# Altium schematic sheet MOD-COIL-LN2-21.SchDoc: MOD-COIL-LN2-21
size A3; SPICEModelCacheRYPVXPCY: <root> / <DocumentId>RYPVXPCY</DocumentId> / </root>; Author: M.Beldyga; CompanyName: WUT ISE; DrawnBy: M.Beldyga; Organization: WUT ISE; Address1: PW ISE; Address2: Nowowiejska 15/19 00-665 Warsaw; Address3: micbeldyga@gmail.com; SheetNumber: 1; SheetTotal: 9; ModifiedBy: -; CheckedDate: -; Title2: MODULIQ; DivGrp: WUT ISE; Designer: M.Beldyga; ModifiedDate: -; ProjectName: Sensor Box
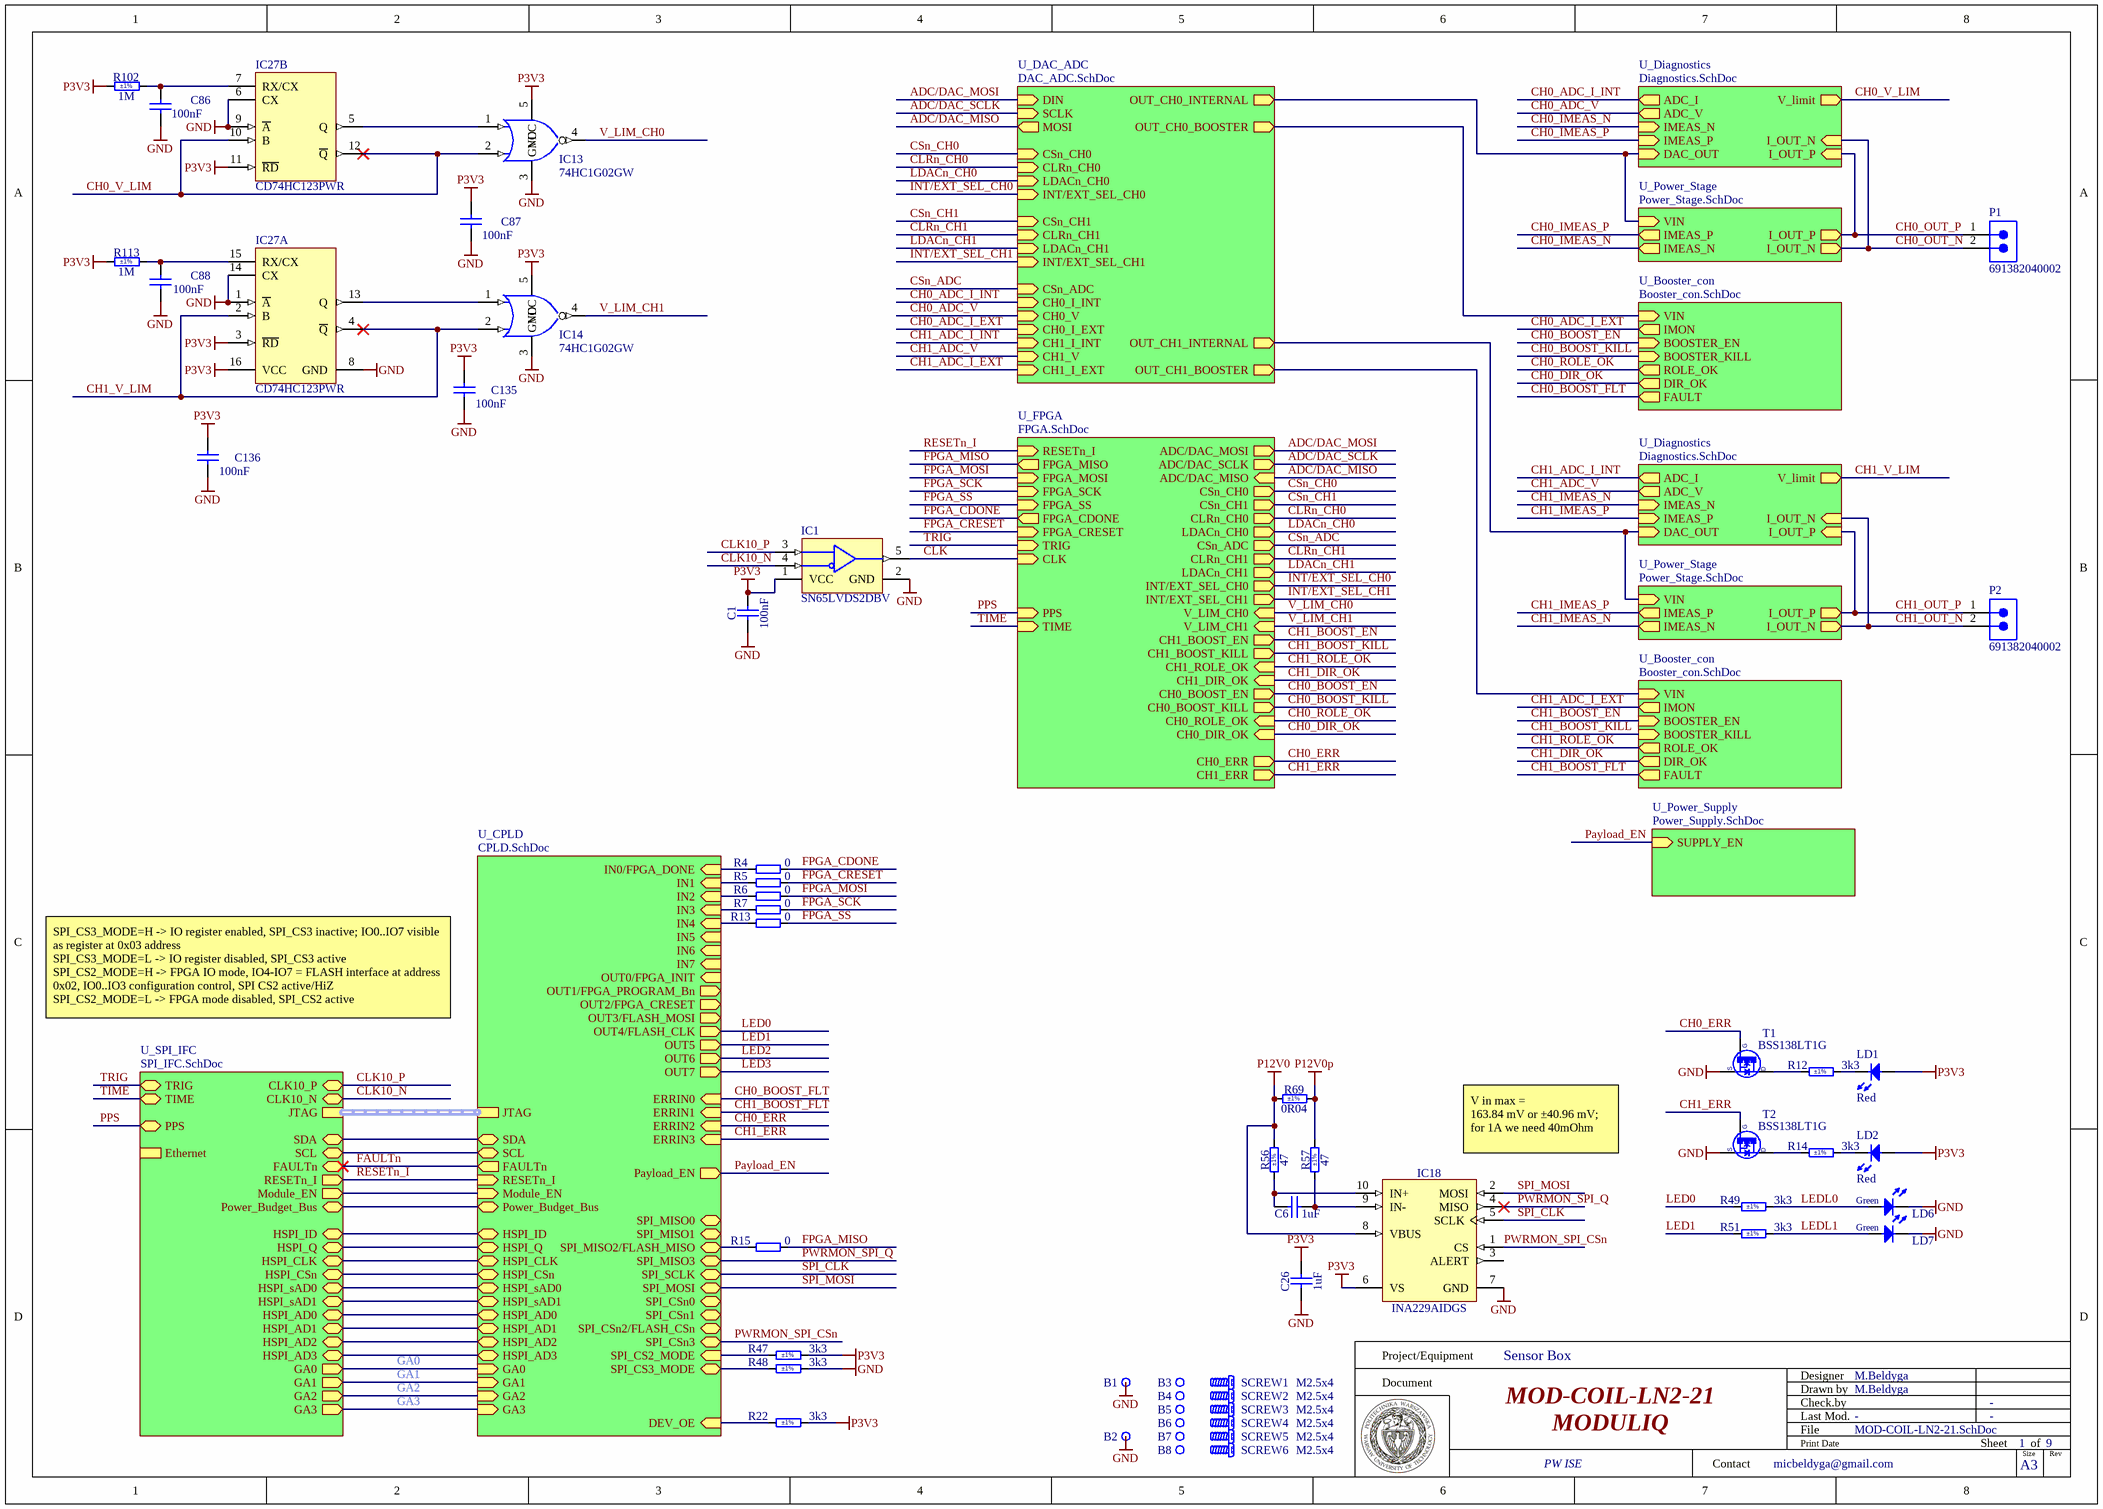
[diagram p0: MOD-COIL-LN2-21.SchDoc]

## Parts
B1  Plated Hole  [MTG270_500]  (value not drawn)  (no BOM)
B2  Plated Hole  [MTG270_500]  (value not drawn)  (no BOM)
B3  Plated Hole  [MTG270_500]  (value not drawn)  (no BOM)
B4  Plated Hole  [MTG270_500]  (value not drawn)  (no BOM)
B5  Plated Hole  [MTG270_500]  (value not drawn)  (no BOM)
B6  Plated Hole  [MTG270_500]  (value not drawn)  (no BOM)
B7  Plated Hole  [MTG270_500]  (value not drawn)  (no BOM)
B8  Plated Hole  [MTG270_500]  (value not drawn)  (no BOM)
C1  100nF  [CAPC1005X55N]
C6  1uF  [CAPC1005X55N]
C26  1uF  [CAPC1005X55N]
C86  100nF  [CAPC1005X55N]
C87  100nF  [CAPC1005X55N]
C88  100nF  [CAPC1005X55N]
C135  100nF  [CAPC1005X55N]
C136  100nF  [CAPC1005X55N]
IC1  SN65LVDS2DBV  [SOT95P280X145-5N]
IC13  74HC1G02GW  [SOT65P212X110-5N]
IC14  74HC1G02GW  [SOT65P212X110-5N]
IC18  INA229AIDGS  [SOP50P490X110-10N]
IC27  CD74HC123PWR  [SOP65P640X110-16N]  (parts A,B of 2)
LD1  Red  [LED_AVAGO_HSMC-C120]
LD2  Red  [LED_AVAGO_HSMC-C120]
LD6  Green  [LED_AVAGO_HSME-C120]
LD7  Green  [LED_AVAGO_HSME-C120]
P1  691382040002  [691382040002]
P2  691382040002  [691382040002]
R4  0  [RESC1005X40N]
R5  0  [RESC1005X40N]
R6  0  [RESC1005X40N]
R7  0  [RESC1005X40N]
R12  3k3  Tolerance: ±1%  [RESC1005X40N]
R13  0  [RESC1005X40N]
R14  3k3  Tolerance: ±1%  [RESC1005X40N]
R15  0  [RESC1005X40N]
R22  3k3  Tolerance: ±1%  [RESC1005X40N]
R47  3k3  Tolerance: ±1%  [RESC1005X40N]
R48  3k3  Tolerance: ±1%  [RESC1005X40N]
R49  3k3  Tolerance: ±1%  [RESC1005X40N]
R51  3k3  Tolerance: ±1%  [RESC1005X40N]
R56  47  Tolerance: ±1%  [RESC1608X55N]
R57  47  Tolerance: ±1%  [RESC1608X55N]
R69  0R04  Tolerance: ±1%  [RESC3216X89N]
R102  1M  Tolerance: ±1%  [RESC1005X40N]
R113  1M  Tolerance: ±1%  [RESC1005X40N]
SCREW1  M2.5x4  [BOSSARD_BN5687-3061587_v]
SCREW2  M2.5x4  [BOSSARD_BN5687-3061587_v]
SCREW3  M2.5x4  [BOSSARD_BN5687-3061587_v]
SCREW4  M2.5x4  [BOSSARD_BN5687-3061587_v]
SCREW5  M2.5x4  [BOSSARD_BN5687-3061587_v]
SCREW6  M2.5x4  [BOSSARD_BN5687-3061587_v]
T1  BSS138LT1G  [SOT95P240X110-3N]
T2  BSS138LT1G  [SOT95P240X110-3N]

## Sub-sheets
U_Booster_con = Booster_con.SchDoc: VIN (in), IMON (out), BOOSTER_EN (in), BOOSTER_KILL (in), ROLE_OK (out), DIR_OK (out), FAULT (out)
U_Booster_con = Booster_con.SchDoc: VIN (in), IMON (out), BOOSTER_EN (in), BOOSTER_KILL (in), ROLE_OK (out), DIR_OK (out), FAULT (out)
U_CPLD = CPLD.SchDoc: SDA (bidir), SCL (bidir), RESETn_I (in), HSPI_ID (bidir), HSPI_Q (bidir), HSPI_CLK (bidir), HSPI_CSn (bidir), HSPI_sAD0 (bidir), HSPI_sAD1 (bidir), HSPI_AD0 (bidir), HSPI_AD1 (bidir), HSPI_AD2 (bidir), HSPI_AD3 (bidir), SPI_MISO2/FLASH_MISO (bidir), SPI_CSn3 (bidir), SPI_CSn1 (bidir), SPI_SCLK (bidir), SPI_MISO3 (bidir), SPI_MISO0 (bidir), SPI_CSn0 (bidir), SPI_MOSI (bidir), SPI_CSn2/FLASH_CSn (bidir), SPI_MISO1 (bidir), GA0 (in), GA1 (in), GA2 (in), GA3 (in), DEV_OE (in), FAULTn (out), Module_EN (in), IN0/FPGA_DONE (in), IN1 (in), IN2 (in), IN3 (in), IN4 (in), IN5 (in), IN6 (in), IN7 (in), OUT0/FPGA_INIT (in), OUT1/FPGA_PROGRAM_Bn (out), OUT2/FPGA_CRESET (out), OUT3/FLASH_MOSI (out), OUT4/FLASH_CLK (out), OUT5 (out), OUT6 (out), OUT7 (out), SPI_CS3_MODE (bidir), SPI_CS2_MODE (in), Payload_EN (out), Power_Budget_Bus (bidir), JTAG (harness JTAG), ERRIN0 (in), ERRIN1 (in), ERRIN2 (in), ERRIN3 (in)
U_DAC_ADC = DAC_ADC.SchDoc: DIN (in), SCLK (in), CSn_CH0 (in), CLRn_CH0 (in), LDACn_CH0 (in), OUT_CH0_INTERNAL (out), OUT_CH0_BOOSTER (out), INT/EXT_SEL_CH0 (in), CSn_CH1 (in), CLRn_CH1 (in), LDACn_CH1 (in), OUT_CH1_INTERNAL (out), OUT_CH1_BOOSTER (out), INT/EXT_SEL_CH1 (in), CSn_ADC (in), CH0_V (in), CH1_V (in), CH0_I_INT (in), CH1_I_INT (in), CH0_I_EXT (in), CH1_I_EXT (in), MOSI (out)
U_Diagnostics = Diagnostics.SchDoc: IMEAS_N (in), DAC_OUT (in), V_limit (out), IMEAS_P (in), ADC_I (out), ADC_V (out), I_OUT_N (in), I_OUT_P (in)
U_Diagnostics = Diagnostics.SchDoc: IMEAS_N (in), DAC_OUT (in), V_limit (out), IMEAS_P (in), ADC_I (out), ADC_V (out), I_OUT_N (in), I_OUT_P (in)
U_FPGA = FPGA.SchDoc: RESETn_I (in), FPGA_MISO (out), FPGA_MOSI (in), FPGA_SCK (in), FPGA_SS (in), FPGA_CDONE (out), FPGA_CRESET (in), TRIG (in), CLK (in), ADC/DAC_MOSI (out), ADC/DAC_SCLK (out), ADC/DAC_MISO (in), CSn_CH0 (out), CSn_CH1 (out), CLRn_CH0 (out), LDACn_CH0 (out), CSn_ADC (out), CLRn_CH1 (out), LDACn_CH1 (out), INT/EXT_SEL_CH0 (out), INT/EXT_SEL_CH1 (out), V_LIM_CH0 (in), V_LIM_CH1 (in), CH1_BOOST_EN (out), CH1_BOOST_KILL (out), CH1_ROLE_OK (in), CH1_DIR_OK (in), CH0_BOOST_EN (out), CH0_BOOST_KILL (out), CH0_ROLE_OK (in), CH0_DIR_OK (in), CH0_ERR (out), CH1_ERR (out), PPS (in), TIME (in)
U_Power_Stage = Power_Stage.SchDoc: VIN (in), IMEAS_P (out), I_OUT_P (out), I_OUT_N (out), IMEAS_N (out)
U_Power_Stage = Power_Stage.SchDoc: VIN (in), IMEAS_P (out), I_OUT_P (out), I_OUT_N (out), IMEAS_N (out)
U_Power_Supply = Power_Supply.SchDoc: SUPPLY_EN (in)
U_SPI_IFC = SPI_IFC.SchDoc: SCL (bidir), CLK10_P (bidir), HSPI_AD3 (bidir), CLK10_N (bidir), RESETn_I (out), SDA (bidir), HSPI_CLK (bidir), HSPI_Q (bidir), HSPI_sAD0 (bidir), HSPI_ID (bidir), HSPI_AD2 (bidir), HSPI_CSn (bidir), HSPI_AD1 (bidir), HSPI_sAD1 (bidir), HSPI_AD0 (bidir), GA0 (out), GA1 (out), GA2 (out), GA3 (out), TRIG (bidir), TIME (bidir), FAULTn (bidir), Module_EN (out), PPS (bidir), Power_Budget_Bus (bidir), JTAG (harness JTAG), Ethernet (harness Ethernet)

## Nets
GND: B1.1 B2.1 C1.1 C26.1 C86.1 C87.1 C88.1 C135.1 C136.1 IC1.2(GND) IC13.3(GND) IC14.3(GND) IC18.7(GND) IC27.1(~{A}) IC27.6(CX) IC27.8(GND) IC27.9(~{A}) IC27.14(CX) LD6.1(C) LD7.1(C) R48.2 T1.2(S) T2.2(S)
P3V3: C1.2 C26.2 C87.2 C135.2 C136.2 IC1.1(VCC) IC13.5(VCC) IC14.5(VCC) IC18.6(VS) IC27.3(~{RD}) IC27.11(~{RD}) IC27.16(VCC) LD1.2(A) LD2.2(A) R22.2 R47.2 R102.1 R113.1
P12V0: IC18.8(VBUS) R56.2 R69.1
P12V0p: R57.2 R69.2
ADC/DAC_MISO: sheet U_FPGA/ADC/DAC_MISO, sheet U_DAC_ADC/MOSI
ADC/DAC_MOSI: sheet U_FPGA/ADC/DAC_MOSI, sheet U_DAC_ADC/DIN
ADC/DAC_SCLK: sheet U_FPGA/ADC/DAC_SCLK, sheet U_DAC_ADC/SCLK
CH0_ADC_I_EXT: sheet U_DAC_ADC/CH0_I_EXT, sheet U_Booster_con/IMON
CH0_ADC_I_INT: sheet U_DAC_ADC/CH0_I_INT, sheet U_Diagnostics/ADC_I
CH0_ADC_V: sheet U_DAC_ADC/CH0_V, sheet U_Diagnostics/ADC_V
CH0_BOOST_EN: sheet U_FPGA/CH0_BOOST_EN, sheet U_Booster_con/BOOSTER_EN
CH0_BOOST_FLT: sheet U_CPLD/ERRIN0, sheet U_Booster_con/FAULT
CH0_BOOST_KILL: sheet U_FPGA/CH0_BOOST_KILL, sheet U_Booster_con/BOOSTER_KILL
CH0_DIR_OK: sheet U_FPGA/CH0_DIR_OK, sheet U_Booster_con/DIR_OK
CH0_ERR: T1.1(G) ; sheet U_CPLD/ERRIN2, sheet U_FPGA/CH0_ERR
CH0_IMEAS_N: sheet U_Power_Stage/IMEAS_N, sheet U_Diagnostics/IMEAS_N
CH0_IMEAS_P: sheet U_Power_Stage/IMEAS_P, sheet U_Diagnostics/IMEAS_P
CH0_OUT_N: P1.2 ; sheet U_Power_Stage/I_OUT_N, sheet U_Diagnostics/I_OUT_N
CH0_OUT_P: P1.1 ; sheet U_Power_Stage/I_OUT_P, sheet U_Diagnostics/I_OUT_P
CH0_ROLE_OK: sheet U_FPGA/CH0_ROLE_OK, sheet U_Booster_con/ROLE_OK
CH0_V_LIM: IC13.2(A) IC27.10(B) IC27.12(~{Q}) ; sheet U_Diagnostics/V_limit
CH1_ADC_I_EXT: sheet U_DAC_ADC/CH1_I_EXT, sheet U_Booster_con/IMON
CH1_ADC_I_INT: sheet U_DAC_ADC/CH1_I_INT, sheet U_Diagnostics/ADC_I
CH1_ADC_V: sheet U_DAC_ADC/CH1_V, sheet U_Diagnostics/ADC_V
CH1_BOOST_EN: sheet U_FPGA/CH1_BOOST_EN, sheet U_Booster_con/BOOSTER_EN
CH1_BOOST_FLT: sheet U_CPLD/ERRIN1, sheet U_Booster_con/FAULT
CH1_BOOST_KILL: sheet U_FPGA/CH1_BOOST_KILL, sheet U_Booster_con/BOOSTER_KILL
CH1_DIR_OK: sheet U_FPGA/CH1_DIR_OK, sheet U_Booster_con/DIR_OK
CH1_ERR: T2.1(G) ; sheet U_CPLD/ERRIN3, sheet U_FPGA/CH1_ERR
CH1_IMEAS_N: sheet U_Power_Stage/IMEAS_N, sheet U_Diagnostics/IMEAS_N
CH1_IMEAS_P: sheet U_Power_Stage/IMEAS_P, sheet U_Diagnostics/IMEAS_P
CH1_OUT_N: P2.2 ; sheet U_Power_Stage/I_OUT_N, sheet U_Diagnostics/I_OUT_N
CH1_OUT_P: P2.1 ; sheet U_Power_Stage/I_OUT_P, sheet U_Diagnostics/I_OUT_P
CH1_ROLE_OK: sheet U_FPGA/CH1_ROLE_OK, sheet U_Booster_con/ROLE_OK
CH1_V_LIM: IC14.2(A) IC27.2(B) IC27.4(~{Q}) ; sheet U_Diagnostics/V_limit
CLK: IC1.5(R) ; sheet U_FPGA/CLK
CLK10_N: IC1.4(B) ; sheet U_SPI_IFC/CLK10_N
CLK10_P: IC1.3(A) ; sheet U_SPI_IFC/CLK10_P
CLRn_CH0: sheet U_FPGA/CLRn_CH0, sheet U_DAC_ADC/CLRn_CH0
CLRn_CH1: sheet U_FPGA/CLRn_CH1, sheet U_DAC_ADC/CLRn_CH1
CSn_ADC: sheet U_FPGA/CSn_ADC, sheet U_DAC_ADC/CSn_ADC
CSn_CH0: sheet U_FPGA/CSn_CH0, sheet U_DAC_ADC/CSn_CH0
CSn_CH1: sheet U_FPGA/CSn_CH1, sheet U_DAC_ADC/CSn_CH1
FAULTn: sheet U_SPI_IFC/FAULTn, sheet U_CPLD/FAULTn
FPGA_CDONE: R4.2 ; sheet U_FPGA/FPGA_CDONE
FPGA_CRESET: R5.2 ; sheet U_FPGA/FPGA_CRESET
FPGA_MISO: R15.2 ; sheet U_FPGA/FPGA_MISO
FPGA_MOSI: R6.2 ; sheet U_FPGA/FPGA_MOSI
FPGA_SCK: R7.2 ; sheet U_FPGA/FPGA_SCK
FPGA_SS: R13.2 ; sheet U_FPGA/FPGA_SS
GA0: sheet U_SPI_IFC/GA0, sheet U_CPLD/GA0
GA1: sheet U_SPI_IFC/GA1, sheet U_CPLD/GA1
GA2: sheet U_SPI_IFC/GA2, sheet U_CPLD/GA2
GA3: sheet U_SPI_IFC/GA3, sheet U_CPLD/GA3
INT/EXT_SEL_CH0: sheet U_FPGA/INT/EXT_SEL_CH0, sheet U_DAC_ADC/INT/EXT_SEL_CH0
INT/EXT_SEL_CH1: sheet U_FPGA/INT/EXT_SEL_CH1, sheet U_DAC_ADC/INT/EXT_SEL_CH1
LDACn_CH0: sheet U_FPGA/LDACn_CH0, sheet U_DAC_ADC/LDACn_CH0
LDACn_CH1: sheet U_FPGA/LDACn_CH1, sheet U_DAC_ADC/LDACn_CH1
LED0: R49.1 ; sheet U_CPLD/OUT4/FLASH_CLK
LED1: R51.1 ; sheet U_CPLD/OUT5
LED2: sheet U_CPLD/OUT6
LED3: sheet U_CPLD/OUT7
LEDL0: LD6.2(A) R49.2
LEDL1: LD7.2(A) R51.2
Payload_EN: sheet U_CPLD/Payload_EN, sheet U_Power_Supply/SUPPLY_EN
PPS: sheet U_SPI_IFC/PPS, sheet U_FPGA/PPS
PWRMON_SPI_CSn: IC18.1(CS) ; sheet U_CPLD/SPI_CSn3
PWRMON_SPI_Q: IC18.4(MISO) ; sheet U_CPLD/SPI_MISO3
RESETn_I: sheet U_SPI_IFC/RESETn_I, sheet U_CPLD/RESETn_I, sheet U_FPGA/RESETn_I
SPI_CLK: IC18.5(SCLK) ; sheet U_CPLD/SPI_SCLK
SPI_MOSI: IC18.2(MOSI) ; sheet U_CPLD/SPI_MOSI
TIME: sheet U_SPI_IFC/TIME, sheet U_FPGA/TIME
TRIG: sheet U_SPI_IFC/TRIG, sheet U_FPGA/TRIG
V_LIM_CH0: IC13.4(Y) ; sheet U_FPGA/V_LIM_CH0
V_LIM_CH1: IC14.4(Y) ; sheet U_FPGA/V_LIM_CH1
NetC6_1: C6.1 IC18.9(IN-) R57.1
NetC6_2: C6.2 IC18.10(IN+) R56.1
NetC86_2: C86.2 IC27.7(RX/CX) R102.2
NetC88_2: C88.2 IC27.15(RX/CX) R113.2
NetIC13_1: IC13.1(B) IC27.5(Q)
NetIC14_1: IC14.1(B) IC27.13(Q)
NetLD1_1: LD1.1(C) R12.2
NetLD2_1: LD2.1(C) R14.2
NetR4_1: R4.1 ; sheet U_CPLD/IN0/FPGA_DONE
NetR5_1: R5.1 ; sheet U_CPLD/IN1
NetR6_1: R6.1 ; sheet U_CPLD/IN2
NetR7_1: R7.1 ; sheet U_CPLD/IN3
NetR12_1: R12.1 T1.3(D)
NetR13_1: R13.1 ; sheet U_CPLD/IN4
NetR14_1: R14.1 T2.3(D)
NetR15_1: R15.1 ; sheet U_CPLD/SPI_MISO2/FLASH_MISO
NetR22_1: R22.1 ; sheet U_CPLD/DEV_OE
NetR47_1: R47.1 ; sheet U_CPLD/SPI_CS2_MODE
NetR48_1: R48.1 ; sheet U_CPLD/SPI_CS3_MODE
(unnamed): sheet U_SPI_IFC/SCL, sheet U_CPLD/SCL
(unnamed): sheet U_SPI_IFC/HSPI_AD3, sheet U_CPLD/HSPI_AD3
(unnamed): sheet U_SPI_IFC/SDA, sheet U_CPLD/SDA
(unnamed): sheet U_SPI_IFC/HSPI_CLK, sheet U_CPLD/HSPI_CLK
(unnamed): sheet U_SPI_IFC/HSPI_Q, sheet U_CPLD/HSPI_Q
(unnamed): sheet U_SPI_IFC/HSPI_sAD0, sheet U_CPLD/HSPI_sAD0
(unnamed): sheet U_SPI_IFC/HSPI_ID, sheet U_CPLD/HSPI_ID
(unnamed): sheet U_SPI_IFC/HSPI_AD2, sheet U_CPLD/HSPI_AD2
(unnamed): sheet U_SPI_IFC/HSPI_CSn, sheet U_CPLD/HSPI_CSn
(unnamed): sheet U_SPI_IFC/HSPI_AD1, sheet U_CPLD/HSPI_AD1
(unnamed): sheet U_SPI_IFC/HSPI_sAD1, sheet U_CPLD/HSPI_sAD1
(unnamed): sheet U_SPI_IFC/HSPI_AD0, sheet U_CPLD/HSPI_AD0
(unnamed): sheet U_SPI_IFC/Module_EN, sheet U_CPLD/Module_EN
(unnamed): sheet U_SPI_IFC/Power_Budget_Bus, sheet U_CPLD/Power_Budget_Bus
(unnamed): sheet U_DAC_ADC/OUT_CH0_INTERNAL, sheet U_Power_Stage/VIN, sheet U_Diagnostics/DAC_OUT
(unnamed): sheet U_DAC_ADC/OUT_CH0_BOOSTER, sheet U_Booster_con/VIN
(unnamed): sheet U_DAC_ADC/OUT_CH1_INTERNAL, sheet U_Power_Stage/VIN, sheet U_Diagnostics/DAC_OUT
(unnamed): sheet U_DAC_ADC/OUT_CH1_BOOSTER, sheet U_Booster_con/VIN

Not connected (* = marked no-connect by the designer): B3 1; B4 1; B5 1; B6 1; B7 1; B8 1; IC18 3(ALERT)

## Buses and harness runs
harness sheet U_CPLD/JTAG = sheet U_SPI_IFC/JTAG

## Notes on the sheet
- SPI_CS3_MODE=H -> IO register enabled, SPI_CS3 inactive; IO0..IO7 visible as register at 0x03 address
  SPI_CS3_MODE=L -> IO register disabled, SPI_CS3 active
  SPI_CS2_MODE=H -> FPGA IO mode, IO4-IO7 = FLASH interface at address 0x02, IO0..IO3 configuration control, SPI CS2 active/HiZ
  SPI_CS2_MODE=L -> FPGA mode disabled, SPI_CS2 active
- (near IC18) V in max =
  163.84 mV or ±40.96 mV; for 1A we need 40mOhm
- Project/Equipment
- Document
- Designer
- Drawn by
- Check.by
- Contact
- File
- Last Mod.
- Print Date
- Sheet
- Size
- A3
- of
- Rev

## Library data of the parts
B1-B8 = PLATED_HOLE2.7_PAD5.0: Single Terminal Socket; Part Description: Plated Through Hole: Hole Dia.=2.7mm Pad Dia.=5.0mm; Mounted: No; Part Number: PLATED_HOLE2.7_PAD5.0; Component Type: Standard (No BOM); Pin Count: 1; Family: Plated Hole; Socket: No; SMD: No; Sense: No; Status: None; ComponentHeight: 0mm; HelpURL: Undefined; Author: CERN DEM JMW; CreateDate: 27.09.2011; LatestRevisionDate: 27.09.2011; PackageDescription: Plated Through Hole: Hole Dia.=2.7mm Pad Dia.=5.0mm
C1 = CC0402_100NF_16V_10%_X7R: Non-polarised capacitor; Part Description: SMD Multilayer Chip Ceramic Capacitor; Manufacturer: GENERIC; Manufacturer1 Part Number: GRM155R71C104KA88D; Voltage: 16V; TC: X7R; Tolerance: ±10%; Part Number: CC0402_100NF_16V_10%_X7R; Component Kind: Standard; Component Type: Standard; Pin Count: 2; Value: 100nF; Status: Not Recommended; Manufacturer Part Number: CC0402_100NF_16V_10%_X7R; Case: 0402; Mounted: Yes; Socket: No; SMD: Yes; Sense: No; Manufacturer1 Example: MURATA; Manufacturer1 ComponentHeight: 0.55mm; HelpURL: \\cern.ch\dfs\Applications\Altium\Datasheets\CC0402_X7R_MURATA_GRM.pdf; Author: CERN DEM JLC; CreateDate: 05.12.2013; LatestRevisionDate: 03.12.2007
C6 C26 = CC0402_1UF_16V_10%_X5R: Non-polarised capacitor; Part Description: SMD Multilayer Chip Ceramic Capacitor; Manufacturer: GENERIC; Manufacturer1 Part Number: C1005X5R1C105KT; Voltage: 16V; TC: X5R; Tolerance: ±10%; Part Number: CC0402_1UF_16V_10%_X5R; Component Kind: Standard; Component Type: Standard; Pin Count: 2; Value: 1uF; Status: Preferred; Manufacturer Part Number: CC0402_1UF_16V_10%_X5R; Case: 0402; Mounted: Yes; Socket: No; SMD: Yes; Sense: No; Manufacturer1 Example: TDK; Manufacturer1 ComponentHeight: 0.55mm; HelpURL: \\cern.ch\dfs\Applications\Altium\Datasheets\CC0402_X5R_TDK_C.pdf; Author: CERN DEM JLC; CreateDate: 25.10.2012; LatestRevisionDate: 25.10.2012
C86-C88 C135 C136 = CC0402_100NF_16V_10%_X5R: Non-polarised capacitor; Part Description: SMD Multilayer Chip Ceramic Capacitor; Manufacturer: GENERIC; Manufacturer1 Part Number: GRM155R61C104KA88D; Voltage: 16V; TC: X5R; Tolerance: ±10%; Part Number: CC0402_100NF_16V_10%_X5R; Component Kind: Standard; Component Type: Standard; Pin Count: 2; Value: 100nF; Status: None; Manufacturer Part Number: CC0402_100NF_16V_10%_X5R; Case: 0402; Mounted: Yes; Socket: No; SMD: Yes; Sense: No; Manufacturer1 Example: MURATA; Manufacturer1 ComponentHeight: 0.55mm; HelpURL: \\cern.ch\dfs\Applications\Altium\Datasheets\CC0402_X5R_MURATA_GRM.pdf; Author: CERN DEM JLC; CreateDate: 10.12.2013; LatestRevisionDate: 10.12.2013
IC1 = SN65LVDS2DBVR: High-Speed Differential Line Receiver; Manufacturer: TEXAS INSTRUMENTS; PressFit: No; Bonding: No; Part Number: SN65LVDS2DBVR; Component Kind: Standard; Component Type: Standard; Device: SN65LVDS2DBV; PackageDescription: SOT, 0.95mm Pitch; 5 Pin, 1.60mm W X 2.90mm L X 1.45mm H body, IPC Medium Density; Part Description: High-Speed Differential Line Receiver; Manufacturer Part Number: SN65LVDS2DBV; Pin Count: 5; Case: SOT23-5; Mounted: Yes; Socket: No; SMD: Yes; Sense: No; ComponentHeight: 1.45mm; Author: CERN DEM JLC; HelpURL: \\cern.ch\dfs\Applications\Altium\Datasheets\SN65LVDS2DBVR.pdf; CreateDate: 3/3/2011; LatestRevisionDate: 3/3/2023
IC13 IC14 = 74HC1G02GW: Single 2-Input NOR Gate; Manufacturer: NEXPERIA; PressFit: No; Bonding: No; Part Number: 74HC1G02GW; Component Kind: Standard; Component Type: Standard; Device: 74HC1G02GW; PackageDescription: SOT353, SC70-5, 0.65mm Pitch; 5 Pin, 1.25mm W X 2.05mm L X 1.10mm H body, IPC Medium Density; Part Description: Single 2-Input NOR Gate; Manufacturer Part Number: 74HC1G02GW; Pin Count: 5; Case: SOT353; Mounted: Yes; Socket: No; SMD: Yes; Sense: No; ComponentHeight: 1.1mm; Author: CERN DEM MR; HelpURL: \\cern.ch\dfs\Applications\Altium\Datasheets\74HC1G02GW.pdf; CreateDate: 12/12/2017; LatestRevisionDate: 3/12/2019
IC18 = INA229AIDGS: 20-Bit, Ultra-Precise Power/Energy/Charge Monitor With SPI Interface; Manufacturer: TEXAS INSTRUMENTS; PressFit: No; Bonding: No; Part Number: INA229AIDGS; Component Kind: Standard; Component Type: Standard; Device: INA229AIDGS; PackageDescription: SOP, 0.50mm Pitch; 10 Pin, 3.00mm W X 3.00mm L X 1.10mm H body, IPC Medium Density; Part Description: 20-Bit, Ultra-Precise Power/Energy/Charge Monitor With SPI Interface; Manufacturer Part Number: INA229AIDGS; Pin Count: 10; Case: MSOP10; Mounted: Yes; Socket: No; SMD: Yes; Sense: No; ComponentHeight: 1.1mm; Author: CERN DEM HF; HelpURL: \\cern.ch\dfs\Applications\Altium\Datasheets\INA229AIDGS.pdf; CreateDate: 06.01.2026; LatestRevisionDate: 06.01.2026
IC27 = CD74HC123PWR: Monostable Multivibrator Dual 16-Pin TSSOP T/R - Tape and Reel (Alt: CD74HC123PW; Manufacturer: Texas Instruments; Manufacturer Lifecycle Status: ACTIVE; High Level Output Current: -5.2mA; Independent Circuits: 2; Low Level Output Current: 5.2mA; Max Junction Temperature (Tj): 150°C; Max Supply Voltage: 6V; Min Supply Voltage: 2V; Nominal Supply Current: 8µA; Number of Inputs: 3; Operating Supply Voltage: 5V; Propagation Delay: 25ns; Schmitt Trigger Input: Yes; Turn-On Delay Time: 54ns; Supplier: DigiKey; Supplier Part Number: 296-12780-1-ND; Manufacturer Part Number: CD74HC123PWR; RoHS: Compliant; Category: Multivibrators; Stock: 12617; Pricing: 1=0.63, 10=0.445, 25=0.3988, 100=0.348, 250=0.32384, 500=0.30928, 1000=0.30294 (USD); Ambient Temperature Range High: 125°C; Case/Package: TSSOP; Contact Plating: Gold; Height: 1.2mm; Lead Free: Lead Free; Length: 5mm; Lifecycle Status: Production; Logic Function: Multivibrator; Max Operating Temperature: 125°C; Min Operating Temperature: -55°C; Mounting Technology: Surface Mount; Number of Bits: 2; Number of Channels: 2; Number of Circuits: 2; Number of Elements: 2; Number of Outputs: 2; Pins: 16; Output Current: 5.2mA; Quiescent Current: 8µA; Radiation Hardening: No; REACH SVHC: No; Schedule B: 8542390000, 8542390000|8542390000|8542390000|8542390000|8542390000|8542390000|8542390000|8542390000|8542390000|8542390000|8542390000|8542390000|8542390000|8542390000|8542390000|8542390000|8542390000|8542390000|8542390000|8542390000|8542390000|8542390000|8542390000|85; Thickness: 1mm; Weight: 61.887009mg; Width: 4.4mm; ComponentLink1URL: https://sigma.octopart.com:443/189718192/technical_drawing/Texas-Instruments-CD74HC123PWR.pdf?src-supplier=Texas+Instruments; ComponentLink1Description: https://sigma.octopart.com:443/189718192/technical_drawing/Texas-Instruments-CD74HC123PWR.pdf?src-supplier=Texas+Instruments; ComponentLink2URL: https://octopart.com:443/opatz8j6/c1?t=597Cc6BOYhl2WAsZO97Y-1T4-Y68k--iF1AzFpPEl80n806VdcYMOlz_tQRAdAksGLDA8QNkiGlgj4FvOf224sGRYbc4e0-HzHl0XEN08B83ah9kvoUTpqEh4jaQnZ2ZCLxOd7hovTgxzZqJi4jTScwcRtaAQAxVlVfKHU7ZuFVZg3qCA4K753Vc-E-3A-IpPC9xjs9lysTI4GgCeIfmAC0BXky314HClp9OMUAcCDxpfqslPnlXvS3HVZdadRp_J-ysxEtSfAfSRP_4BuQBa-rlrligPBVQfK6uuCn_vqwKNYYFK12X__dN3EEaZVKKf-rDjDwY43-9bWYmihcp153EDOxaB96V1ytHqbyt8muN78T_vU-3bgz2cniZaNyOph-_PQ&src-supplier=Texas+Instruments; ComponentLink2Description: https://octopart.com:443/opatz8j6/c1?t=597Cc6BOYhl2WAsZO97Y-1T4-Y68k--iF1AzFpPEl80n806VdcYMOlz_tQRAdAksGLDA8QNkiGlgj4FvOf224sGRYbc4e0-HzHl0XEN08B83ah9kvoUTpqEh4jaQnZ2ZCLxOd7hovTgxzZqJi4jTScwcRtaAQAxVlVfKHU7ZuFVZg3qCA4K753Vc-E-3A-IpPC9xjs9lysTI4GgCeIfmAC0BXky314HClp9OMUAcCDxpfqslPnlXvS3HVZdadRp_J-ysxEtSfAfSRP_4BuQBa-rlrligPBVQfK6uuCn_vqwKNYYFK12X__dN3EEaZVKKf-rDjDwY43-9bWYmihcp153EDOxaB96V1ytHqbyt8muN78T_vU-3bgz2cniZaNyOph-_PQ&src-supplier=Texas+Instruments; ComponentLink3URL: https://sigma.octopart.com:443/116621398/technical_drawing/Texas-Instruments-CD74HC123PWR.pdf?src-supplier=Texas+Instruments; ComponentLink3Description: https://sigma.octopart.com:443/116621398/technical_drawing/Texas-Instruments-CD74HC123PWR.pdf?src-supplier=Texas+Instruments; ComponentLink4URL: https://datasheet.octopart.com:443/CD74HC123PWR-Texas-Instruments-datasheet-41204771.pdf?src-supplier=Texas+Instruments; ComponentLink4Description: https://datasheet.octopart.com:443/CD74HC123PWR-Texas-Instruments-datasheet-41204771.pdf?src-supplier=Texas+Instruments; ComponentLink5URL: https://datasheet.octopart.com:443/CD74HC123PWR-Texas-Instruments-datasheet-10253585.pdf?src-supplier=Texas+Instruments; ComponentLink5Description: https://datasheet.octopart.com:443/CD74HC123PWR-Texas-Instruments-datasheet-10253585.pdf?src-supplier=Texas+Instruments; ComponentLink6URL: https://sigma.octopart.com:443/49249815/technical_drawing/Texas-Instruments-CD74HC123PWR.pdf?src-supplier=Texas+Instruments; ComponentLink6Description: https://sigma.octopart.com:443/49249815/technical_drawing/Texas-Instruments-CD74HC123PWR.pdf?src-supplier=Texas+Instruments; ComponentLink7URL: https://datasheet.octopart.com:443/CD74HC123PWR-Texas-Instruments-datasheet-151236.pdf?src-supplier=Texas+Instruments; ComponentLink7Description: https://datasheet.octopart.com:443/CD74HC123PWR-Texas-Instruments-datasheet-151236.pdf?src-supplier=Texas+Instruments; ComponentLink8URL: https://datasheet.octopart.com:443/CD74HC123PWR-Texas-Instruments-datasheet-11534171.pdf?src-supplier=Newark; ComponentLink8Description: https://datasheet.octopart.com:443/CD74HC123PWR-Texas-Instruments-datasheet-11534171.pdf?src-supplier=Newark; ComponentLink9URL: https://datasheet.octopart.com:443/CD74HC123PWR-Texas-Instruments-datasheet-21220252.pdf?src-supplier=Newark; ComponentLink9Description: https://datasheet.octopart.com:443/CD74HC123PWR-Texas-Instruments-datasheet-21220252.pdf?src-supplier=Newark; ComponentLink10URL: https://datasheet.octopart.com:443/CD74HC123PWR.-Texas-Instruments-datasheet-62342740.pdf?src-supplier=Farnell; ComponentLink10Description: https://datasheet.octopart.com:443/CD74HC123PWR.-Texas-Instruments-datasheet-62342740.pdf?src-supplier=Farnell; ComponentLink11URL: https://datasheet.octopart.com:443/CD74HC123PWR.-Texas-Instruments-datasheet-95279666.pdf?src-supplier=Farnell; ComponentLink11Description: https://datasheet.octopart.com:443/CD74HC123PWR.-Texas-Instruments-datasheet-95279666.pdf?src-supplier=Farnell; ComponentLink12URL: https://datasheet.octopart.com:443/CD74HC123PWR-Texas-Instruments-datasheet-165803818.pdf?src-supplier=LCSC; ComponentLink12Description: https://datasheet.octopart.com:443/CD74HC123PWR-Texas-Instruments-datasheet-165803818.pdf?src-supplier=LCSC; ComponentLink13URL: https://datasheet.octopart.com:443/CD74HC123PWR-Texas-Instruments-datasheet-159114808.pdf?src-supplier=LCSC; ComponentLink13Description: https://datasheet.octopart.com:443/CD74HC123PWR-Texas-Instruments-datasheet-159114808.pdf?src-supplier=LCSC; ComponentLink14URL: https://datasheet.octopart.com:443/CD74HC123PWR-Texas-Instruments-datasheet-151312752.pdf?src-supplier=SHENGYU+ELECTRONICS; ComponentLink14Description: https://datasheet.octopart.com:443/CD74HC123PWR-Texas-Instruments-datasheet-151312752.pdf?src-supplier=SHENGYU+ELECTRONICS; ComponentLink15URL: https://datasheet.octopart.com:443/CD74HC123PWR-Texas-Instruments-datasheet-137316104.pdf?src-supplier=Future+Electronics; ComponentLink15Description: https://datasheet.octopart.com:443/CD74HC123PWR-Texas-Instruments-datasheet-137316104.pdf?src-supplier=Future+Electronics; ComponentLink16URL: https://datasheet.octopart.com:443/CD74HC123PWR-Texas-Instruments-datasheet-14149716.pdf?src-supplier=iiiC; ComponentLink16Description: https://datasheet.octopart.com:443/CD74HC123PWR-Texas-Instruments-datasheet-14149716.pdf?src-supplier=iiiC; ComponentLink17URL: https://datasheet.octopart.com:443/CD74HC123PWR-Texas-Instruments-datasheet-10884682.pdf?src-supplier=Arrow+Electronics; ComponentLink17Description: https://datasheet.octopart.com:443/CD74HC123PWR-Texas-Instruments-datasheet-10884682.pdf?src-supplier=Arrow+Electronics; ComponentLink18URL: https://datasheet.octopart.com:443/CD74HC123PWR-Texas-Instruments-datasheet-54595.pdf?src-supplier=DigiKey; ComponentLink18Description: https://datasheet.octopart.com:443/CD74HC123PWR-Texas-Instruments-datasheet-54595.pdf?src-supplier=DigiKey; ComponentLink19URL: http://sigma.octopart.com:80/reach_statement/Texas-Instruments-company-64.pdf?src-supplier=Compliance+Statements; ComponentLink19Description: http://sigma.octopart.com:80/reach_statement/Texas-Instruments-company-64.pdf?src-supplier=Compliance+Statements; ComponentLink20URL: http://sigma.octopart.com:80/conflict_mineral_statement/Texas-Instruments-company-63.pdf?src-supplier=Compliance+Statements; ComponentLink20Description: http://sigma.octopart.com:80/conflict_mineral_statement/Texas-Instruments-company-63.pdf?src-supplier=Compliance+Statements
LD1 LD2 = LED_AVAGO_HSMC-C120: LED Red 1C 2A; Part Description: High Performance Right Angle Chip Red LED; Manufacturer: AVAGO TECHNOLOGIES; PressFit: No; Bonding: No; Part Number: LED_AVAGO_HSMC-C120; Component Kind: Standard; Component Type: Standard; Color: Red; PackageDescription: Red Chip LED, 2-Leads, Body 1.7x1.1mm, Side Emitting Package; Status: Not Recommended; Manufacturer Part Number: HSMC-C120; Pin Count: 2; Mounted: Yes; Socket: No; SMD: Yes; Sense: No; ComponentHeight: 0.7mm; HelpURL: \\cern.ch\dfs\Applications\Altium\Datasheets\LED_AVAGO_HSMC-C120.pdf; ComponentLink1URL: \\cern.ch\dfs\Applications\Altium\Datasheets\LED_AVAGO_HSMC-C120_DESIGN-GUIDE.pdf; ComponentLink1Description: Design Guide; Author: CERN DEM JMW; CreateDate: 7/22/2009; LatestRevisionDate: 6/20/2012
LD6 LD7 = LED_AVAGO_HSME-C120: LED Green 1C 2A; Part Description: High Performance Right Angle Chip Green LED; Manufacturer: AVAGO TECHNOLOGIES; PressFit: No; Bonding: No; Part Number: LED_AVAGO_HSME-C120; Component Kind: Standard; Component Type: Standard; Color: Green; PackageDescription: Green Chip LED, 2-Leads, Body 1.7x1.1mm, Side Emitting Package; Manufacturer Part Number: HSME-C120; Pin Count: 2; Mounted: Yes; Socket: No; SMD: Yes; Sense: No; ComponentHeight: 0.7mm; HelpURL: \\cern.ch\dfs\Applications\Altium\Datasheets\LED_AVAGO_HSME-C120.pdf; Author: CERN DEM JMW; CreateDate: 22.07.2009; LatestRevisionDate: 20.06.2012; Status: Not Recommended; ComponentLink1URL: \\cern.ch\dfs\Applications\Altium\Datasheets\LED_AVAGO_HSME-C110_DESIGN-GUIDE.pdf; ComponentLink1Description: Design Guide
P1 P2 = 691382040002: WR-TBL Series 382 Horizontal PCB Header with Flanges, THT, pitch 2.5mm, 2p; Manufacturer: Wurth Elektronik; Modularity: No; Rated Current: 4A; Working Voltage: 300V; Manufacturer Part Number: 691382040002; Category: Terminal Blocks; Match Code: WR-TBL; ComponentLink1Description: Website Link; ComponentLink1URL: https://www.we-online.com/redexpert/article/691382040002?ad; ComponentLink2Description: Datasheet Link; ComponentLink2URL: https://www.we-online.com/redexpert/spec/691382040002?ad; Mount: Through Hole; Operating Temperature Max: 105°C; Operating Temperature Min: -40°C; Packaging: Box; Application: Pluggable; Number of Pins: 2; Number of Rows: 1; Orientation: Horizontal; Pitch: 2.5mm
R4-R7 R13 R15 = R0402_0R_JUMPER: Resistor; Part Description: 1A (0.05R Max DC Resistance) Zero Ohm Jumper; Manufacturer: GENERIC; Manufacturer1 Part Number: 232270591001L; PressFit: No; Part Number: R0402_0R_JUMPER; Component Kind: Standard; Component Type: Standard; Pin Count: 2; Value: 0; Status: Not Recommended; Manufacturer Part Number: R0402_0R_JUMPER; Case: 0402; Mounted: Yes; Sense: No; Socket: No; SMD: Yes; Manufacturer1 Example: YAGEO PHYCOMP; Manufacturer1 ComponentHeight: 0.4mm; HelpURL: \\cern.ch\dfs\Applications\Altium\Datasheets\R0402_Phycomp_RC0402.pdf; Author: CERN DEM JLC; CreateDate: 03.12.2007; LatestRevisionDate: 17.10.2012
R12 R14 R22 R47-R49 R51 = R0402_3K3_1%_0.0625W_100PPM: Resistor - 1%; Part Description: General Purpose Thick Film Chip Resistor; Manufacturer: GENERIC; Manufacturer1 Part Number: 232270673302L; TC: ±100ppm/°C; PressFit: No; Part Number: R0402_3K3_1%_0.0625W_100PPM; Component Kind: Standard; Component Type: Standard; Pin Count: 2; Value: 3k3; Status: Not Recommended; Power: 0.0625W; Manufacturer Part Number: R0402_3K3_1%_0.0625W_100PPM; Case: 0402; Mounted: Yes; Sense: No; Socket: No; SMD: Yes; Manufacturer1 Example: YAGEO PHYCOMP; Manufacturer1 ComponentHeight: 0.4mm; HelpURL: \\cern.ch\dfs\Applications\Altium\Datasheets\R0402_Phycomp_RC0402.pdf; Author: CERN DEM JLC; CreateDate: 03.12.2007; LatestRevisionDate: 17.10.2012
R56 R57 = R0603_47R_1%_0.1W_100PPM: Resistor - 1%; Part Description: General Purpose Thick Film Chip Resistor; Manufacturer: GENERIC; Manufacturer1 Part Number: NRC06F47R0TRF; Power: 0.1W; TC: ±100ppm/°C; PressFit: No; Part Number: R0603_47R_1%_0.1W_100PPM; Component Kind: Standard; Component Type: Standard; Pin Count: 2; Value: 47; Status: Preferred; Manufacturer Part Number: R0603_47R_1%_0.1W_100PPM; Case: 0603; Mounted: Yes; Sense: No; Socket: No; SMD: Yes; Manufacturer1 Example: NIC COMPONENT; Manufacturer1 ComponentHeight: 0.55mm; HelpURL: \\cern.ch\dfs\Applications\Altium\Datasheets\R0603_NIC_NRC.pdf; Author: CERN DEM JLC; CreateDate: 03.12.2007; LatestRevisionDate: 13.03.2008
R69 = R1206_0R04_1%_0.25W_75PPM_VISHAY_WSL: Resistor - 1%; Part Description: Power Metal Strip® Resistor, Low Value; Manufacturer: VISHAY DALE; Manufacturer Part Number: WSL1206R0400FEA; Power: 0.25W; TC: ±75ppm/°C; PressFit: No; Part Number: R1206_0R04_1%_0.25W_75PPM_VISHAY_WSL; Component Kind: Standard; Component Type: Standard; Pin Count: 2; Value: 0R04; Status: None; Case: 1206; Mounted: Yes; Sense: No; Socket: No; SMD: Yes; ComponentHeight: 0.89mm; HelpURL: \\cern.ch\dfs\Applications\Altium\Datasheets\R1206_VISHAY_WSL.pdf; Author: CERN DEM JMW; CreateDate: 06.07.2015; LatestRevisionDate: 06.07.2015
R102 R113 = R0402_1M_1%_0.0625W_100PPM: Resistor - 1%; Part Description: General Purpose Thick Film Chip Resistor; Manufacturer: GENERIC; Manufacturer1 Part Number: 232270671005L; TC: ±100ppm/°C; PressFit: No; Part Number: R0402_1M_1%_0.0625W_100PPM; Component Kind: Standard; Component Type: Standard; Pin Count: 2; Value: 1M; Status: Not Recommended; Power: 0.0625W; Manufacturer Part Number: R0402_1M_1%_0.0625W_100PPM; Case: 0402; Mounted: Yes; Sense: No; Socket: No; SMD: Yes; Manufacturer1 ComponentHeight: 0.4mm; HelpURL: \\cern.ch\dfs\Applications\Altium\Datasheets\R0402_Phycomp_RC0402.pdf; Author: CERN DEM JLC; CreateDate: 12/3/2007; LatestRevisionDate: 10/17/2012; Manufacturer1 Example: YAGEO PHYCOMP
SCREW1-SCREW6 = BOSSARD_BN5687-3061587_v: Screw; Part Description: M2.5 L=4mm Hexalobular Socket Pan Head Screw, Fully Threaded, Stainless Steel A2; Manufacturer Part Number: BN5687 Art.3061587; PressFit: No; ClassName: Overlapping; Part Number: BOSSARD_BN5687-3061587_v; Component Kind: Standard; Component Type: Mechanical; Pin Count: 0; PackageDescription: M2.5 L=4mm Hexalobular Socket Pan Head Screw, Fully Threaded - Stainless Steel A2; Mounted: Yes; Socket: No; SMD: No; Sense: No; Status: None; Value: M2.5x4; Manufacturer: BOSSARD; ComponentHeight: 2.1mm; HelpURL: \\cern.ch\dfs\Applications\Altium\Datasheets\BOSSARD_BN5687-3061587.pdf; Author: CERN DEM JLC; CreateDate: 22.08.2013; LatestRevisionDate: 22.08.2013
T1 T2 = BSS138LT1G: N-CHANNEL MOSFET WITH DIODE; Part Description: 50V 200mA N-Channel Enhancement Mode Field-Effect Transistor; Manufacturer1: ON SEMICONDUCTOR; PressFit: No; Bonding: No; Part Number: BSS138LT1G; Component Kind: Standard; Component Type: Standard; Device: BSS138LT1G; PackageDescription: SOT23 3-Leads, Pitch 0.95mm - Body 1.4x3mm, IPC Medium Density; Manufacturer1 Part Number: BSS138LT1G; Pin Count: 3; Case: SOT23-3; Mounted: Yes; Socket: No; SMD: Yes; Sense: No; ComponentHeight: 1.11mm; HelpURL: \\cern.ch\dfs\Applications\Altium\Datasheets\BSS138LT1G.pdf; Author: CERN DEM JLC; CreateDate: 23.03.2009; LatestRevisionDate: 23.03.2009